# Altium schematic sheet MIPI-CAMERA.SchDoc
size 297 x 209 mm; SheetNumber: 29; SheetTotal: 32
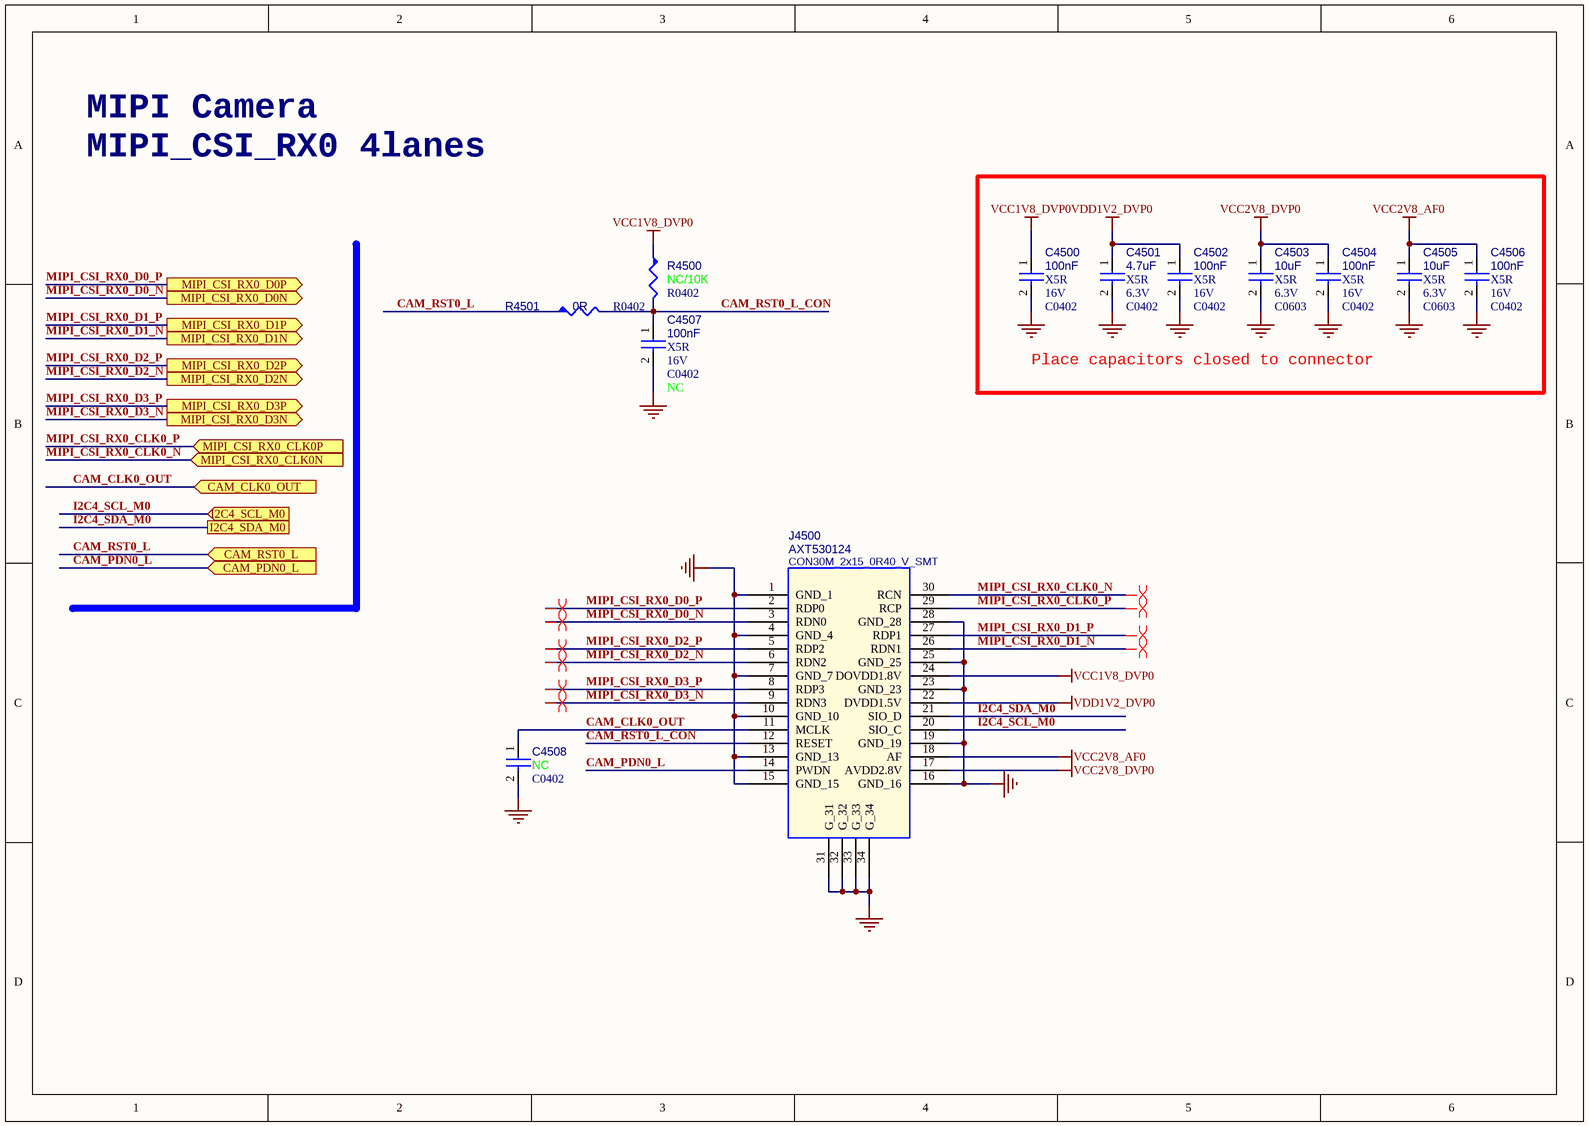
[diagram p0: MIPI-CAMERA.SchDoc]

## Parts
C4500  100nF  Dielectric: X5R  Voltage: 16V  [C0402]
C4501  4.7uF  Dielectric: X5R  Voltage: 6.3V  [C0402]
C4502  100nF  Dielectric: X5R  Voltage: 16V  [C0402]
C4503  10uF  Dielectric: X5R  Voltage: 6.3V  [C0603]
C4504  100nF  Dielectric: X5R  Voltage: 16V  [C0402]
C4505  10uF  Dielectric: X5R  Voltage: 6.3V  [C0603]
C4506  100nF  Dielectric: X5R  Voltage: 16V  [C0402]
C4507  100nF  Dielectric: X5R  Voltage: 16V  Option: NC  [C0402]
C4508  NC  [C0402]
J4500  AXT530124  PCB Footprint: CON30M_2x15_0R40_V_SMT  [CONN-SMD_30P-P0.40_AXT530124]
R4500  NC/10K  [R0402]
R4501  0R  [R0402]

## Blocks framed on the sheet
Place capacitors closed to connector: C4500-C4506

## Ports
CAM_CLK0_OUT (in, see Controller-RK3562-TOP[7B], CONTROLLER-RK3562[3C], RK3562-VCCIO5[4D]), CAM_PDN0_L (in, see Controller-RK3562-TOP[7B], CONTROLLER-RK3562[3C], RK3562-VCCIO5[4D]), CAM_RST0_L (in, see Controller-RK3562-TOP[7B], CONTROLLER-RK3562[3C], RK3562-VCCIO5[4D]), I2C4_SCL_M0 (in, see Controller-RK3562-TOP[7B], CONTROLLER-RK3562[3C], RK3562-VCCIO5[4D]), I2C4_SDA_M0 (see Controller-RK3562-TOP[7B], CONTROLLER-RK3562[3C], RK3562-VCCIO5[4D]), MIPI_CSI_RX0_CLK0N (in, see Controller-RK3562-TOP[7B], CONTROLLER-RK3562[3C], RK3562-VCCIO5[2B]), MIPI_CSI_RX0_CLK0P (in, see Controller-RK3562-TOP[7B], CONTROLLER-RK3562[3C], RK3562-VCCIO5[2A]), MIPI_CSI_RX0_D0N (out, see Controller-RK3562-TOP[7B], CONTROLLER-RK3562[3B], RK3562-VCCIO5[2A]), MIPI_CSI_RX0_D0P (out, see Controller-RK3562-TOP[7B], CONTROLLER-RK3562[3B], RK3562-VCCIO5[2A]), MIPI_CSI_RX0_D1N (out, see Controller-RK3562-TOP[7B], CONTROLLER-RK3562[3C], RK3562-VCCIO5[2A]), MIPI_CSI_RX0_D1P (out, see Controller-RK3562-TOP[7B], CONTROLLER-RK3562[3B], RK3562-VCCIO5[2A]), MIPI_CSI_RX0_D2N (out, see Controller-RK3562-TOP[7B], CONTROLLER-RK3562[3C], RK3562-VCCIO5[2A]), MIPI_CSI_RX0_D2P (out, see Controller-RK3562-TOP[7B], CONTROLLER-RK3562[3C], RK3562-VCCIO5[2A]), MIPI_CSI_RX0_D3N (out, see Controller-RK3562-TOP[7B], CONTROLLER-RK3562[3C], RK3562-VCCIO5[2A]), MIPI_CSI_RX0_D3P (out, see Controller-RK3562-TOP[7B], CONTROLLER-RK3562[3C], RK3562-VCCIO5[2A])

## Nets
GND: C4500.2 C4501.2 C4502.2 C4503.2 C4504.2 C4505.2 C4506.2 C4507.2 C4508.2 J4500.1(GND_1) J4500.4(GND_4) J4500.7(GND_7) J4500.10(GND_10) J4500.13(GND_13) J4500.15(GND_15) J4500.16(GND_16) J4500.19(GND_19) J4500.23(GND_23) J4500.25(GND_25) J4500.28(GND_28) J4500.31(G_31) J4500.32(G_32) J4500.33(G_33) J4500.34(G_34)
VCC1V8_DVP0: C4500.1 J4500.24(DOVDD1.8V) R4500.1
VCC2V8_AF0: C4505.1 C4506.1 J4500.18(AF)
VCC2V8_DVP0: C4503.1 C4504.1 J4500.17(AVDD2.8V)
VDD1V2_DVP0: C4501.1 C4502.1 J4500.22(DVDD1.5V)
CAM_CLK0_OUT: C4508.1 J4500.11(MCLK) ; port CAM_CLK0_OUT
CAM_PDN0_L: J4500.14(PWDN) ; port CAM_PDN0_L
CAM_RST0_L: R4501.1 ; port CAM_RST0_L
CAM_RST0_L_CON: C4507.1 J4500.12(RESET) R4500.2 R4501.2
I2C4_SCL_M0: J4500.20(SIO_C) ; port I2C4_SCL_M0
I2C4_SDA_M0: J4500.21(SIO_D) ; port I2C4_SDA_M0
MIPI_CSI_RX0_CLK0_N: J4500.30(RCN) ; port MIPI_CSI_RX0_CLK0N
MIPI_CSI_RX0_CLK0_P: J4500.29(RCP) ; port MIPI_CSI_RX0_CLK0P
MIPI_CSI_RX0_D0_N: J4500.3(RDN0) ; port MIPI_CSI_RX0_D0N
MIPI_CSI_RX0_D0_P: J4500.2(RDP0) ; port MIPI_CSI_RX0_D0P
MIPI_CSI_RX0_D1_N: J4500.26(RDN1) ; port MIPI_CSI_RX0_D1N
MIPI_CSI_RX0_D1_P: J4500.27(RDP1) ; port MIPI_CSI_RX0_D1P
MIPI_CSI_RX0_D2_N: J4500.6(RDN2) ; port MIPI_CSI_RX0_D2N
MIPI_CSI_RX0_D2_P: J4500.5(RDP2) ; port MIPI_CSI_RX0_D2P
MIPI_CSI_RX0_D3_N: J4500.9(RDN3) ; port MIPI_CSI_RX0_D3N
MIPI_CSI_RX0_D3_P: J4500.8(RDP3) ; port MIPI_CSI_RX0_D3P

## Layout directives
differential pair: MIPI_CSI_RX0_CLK0_N, MIPI_CSI_RX0_CLK0_P, MIPI_CSI_RX0_D0_N, MIPI_CSI_RX0_D0_P, MIPI_CSI_RX0_D1_N, MIPI_CSI_RX0_D1_P, MIPI_CSI_RX0_D2_N, MIPI_CSI_RX0_D2_P, MIPI_CSI_RX0_D3_N, MIPI_CSI_RX0_D3_P

## Notes on the sheet
- MIPI Camera
  MIPI_CSI_RX0 4lanes

## Library data of the parts
C4500 = CAP NP: cap,100.00nF,+/-10%,16V,X5R,C0402; Part Reference: C4500; Manufacturer PN: C1005X5R1C104K050BA; Manufacturer: TDK; Tolerance: 10%; Priority: A; PCB Footprint: C0402; Value: 100nF; Created by: JJJ; Part Type: C0402; RK PN: C1005X5R1C104K050BA
C4501 = CAP NP: cap,4.70uF,+/-10%,6.3V,X5R,C0402; Part Reference: C4501; Manufacturer PN: C1005X5R0J475K050BC; Manufacturer: TDK; Tolerance: 10%; Priority: A; PCB Footprint: C0402; Value: 4.7uF; Created by: JJJ; Part Type: C0402; RK PN: C1005X5R0J475K050BC
C4502 = CAP NP: cap,100.00nF,+/-10%,16V,X5R,C0402; Part Reference: C4502; Manufacturer PN: C1005X5R1C104K050BA; Manufacturer: TDK; Tolerance: 10%; Priority: A; PCB Footprint: C0402; Value: 100nF; Created by: JJJ; Part Type: C0402; RK PN: C1005X5R1C104K050BA
C4503 = CAP NP: cap,10.00uF,+/-10%,6.3V,X5R,C0603; Part Reference: C4503; Manufacturer PN: C1608X5R0J106K080AB; Manufacturer: TDK; Tolerance: 10%; Priority: A; PCB Footprint: C0603; Value: 10uF; Created by: JJJ; Part Type: C0603; RK PN: C1608X5R0J106K080AB
C4504 = CAP NP: cap,100.00nF,+/-10%,16V,X5R,C0402; Part Reference: C4504; Manufacturer: TDK; RK PN: C1005X5R1C104K050BA; Priority: A; Tolerance: 10%; PCB Footprint: C0402; Value: 100nF; Part Type: C0402; Manufacturer PN: C1005X5R1C104K050BA; Created by: JJJ
C4505 = CAP NP: cap,10.00uF,+/-10%,6.3V,X5R,C0603; Part Reference: C4505; Manufacturer: TDK; RK PN: C1608X5R0J106K080AB; Priority: A; Tolerance: 10%; PCB Footprint: C0603; Value: 10uF; Part Type: C0603; Manufacturer PN: C1608X5R0J106K080AB; Created by: JJJ
C4506 = CAP NP: cap,100.00nF,+/-10%,16V,X5R,C0402; Part Reference: C4506; Manufacturer: TDK; RK PN: C1005X5R1C104K050BA; Priority: A; Tolerance: 10%; PCB Footprint: C0402; Value: 100nF; Part Type: C0402; Manufacturer PN: C1005X5R1C104K050BA; Created by: JJJ
C4507 = CAP NP: cap,100.00nF,+/-10%,16V,X5R,C0402; Part Reference: C4507; Manufacturer PN: C1005X5R1C104K050BA; Manufacturer: TDK; Tolerance: 10%; Priority: A; PCB Footprint: C0402; Value: 100nF; Created by: JJJ; Part Type: C0402; RK PN: C1005X5R1C104K050BA
C4508 = CAP NP_NC: NC电容，无容值.; Part Reference: C4508; Optional: X; Priority: A; RK PN: 902012106-1; PCB Footprint: C0402; Value: NC; Created by: JJJ; Part Type: NC电容
J4500 = CMK-CB0077-FV1_2: Rockchips内部通用双排30PIN for MIPI CSI摄像头接口；; Part Reference: J4500; Manufacturer: Panasonic; Priority: A; Value: AXT530124; RK PN: AXT530124; Part Type: Camera Connector; Manufacturer Part Number: AXT530124; Created by: JJJ
R4500 = RESISTOR5_NC: 通用厚膜电阻,10K,+/-5%,R0402,1/16W.; Part Reference: R4500; Manufacturer: YAGEO; Manufacturer PN: RC0402JR-0710KL; Tolerance: 5%; RK PN: 901001449-1; Priority: A; Wattage: 1/16W; Optional: X; PCB Footprint: R0402; Value: NC/10K; Part Type: 通用厚膜电阻; Created by: YTL
R4501 = RESISTOR5: 通用厚膜电阻,0R,+/-5%,R0402,1/16W.; Part Reference: R4501; Manufacturer PN: RC0402JR-070RL; Manufacturer: YAGEO; Tolerance: 5%; Wattage: 1/16W; Priority: A; RK PN: 901001446; PCB Footprint: R0402; Value: 0R; Created by: YTL; Part Type: 通用厚膜电阻